# EAGLE design templog (EAGLE 9.5.0)
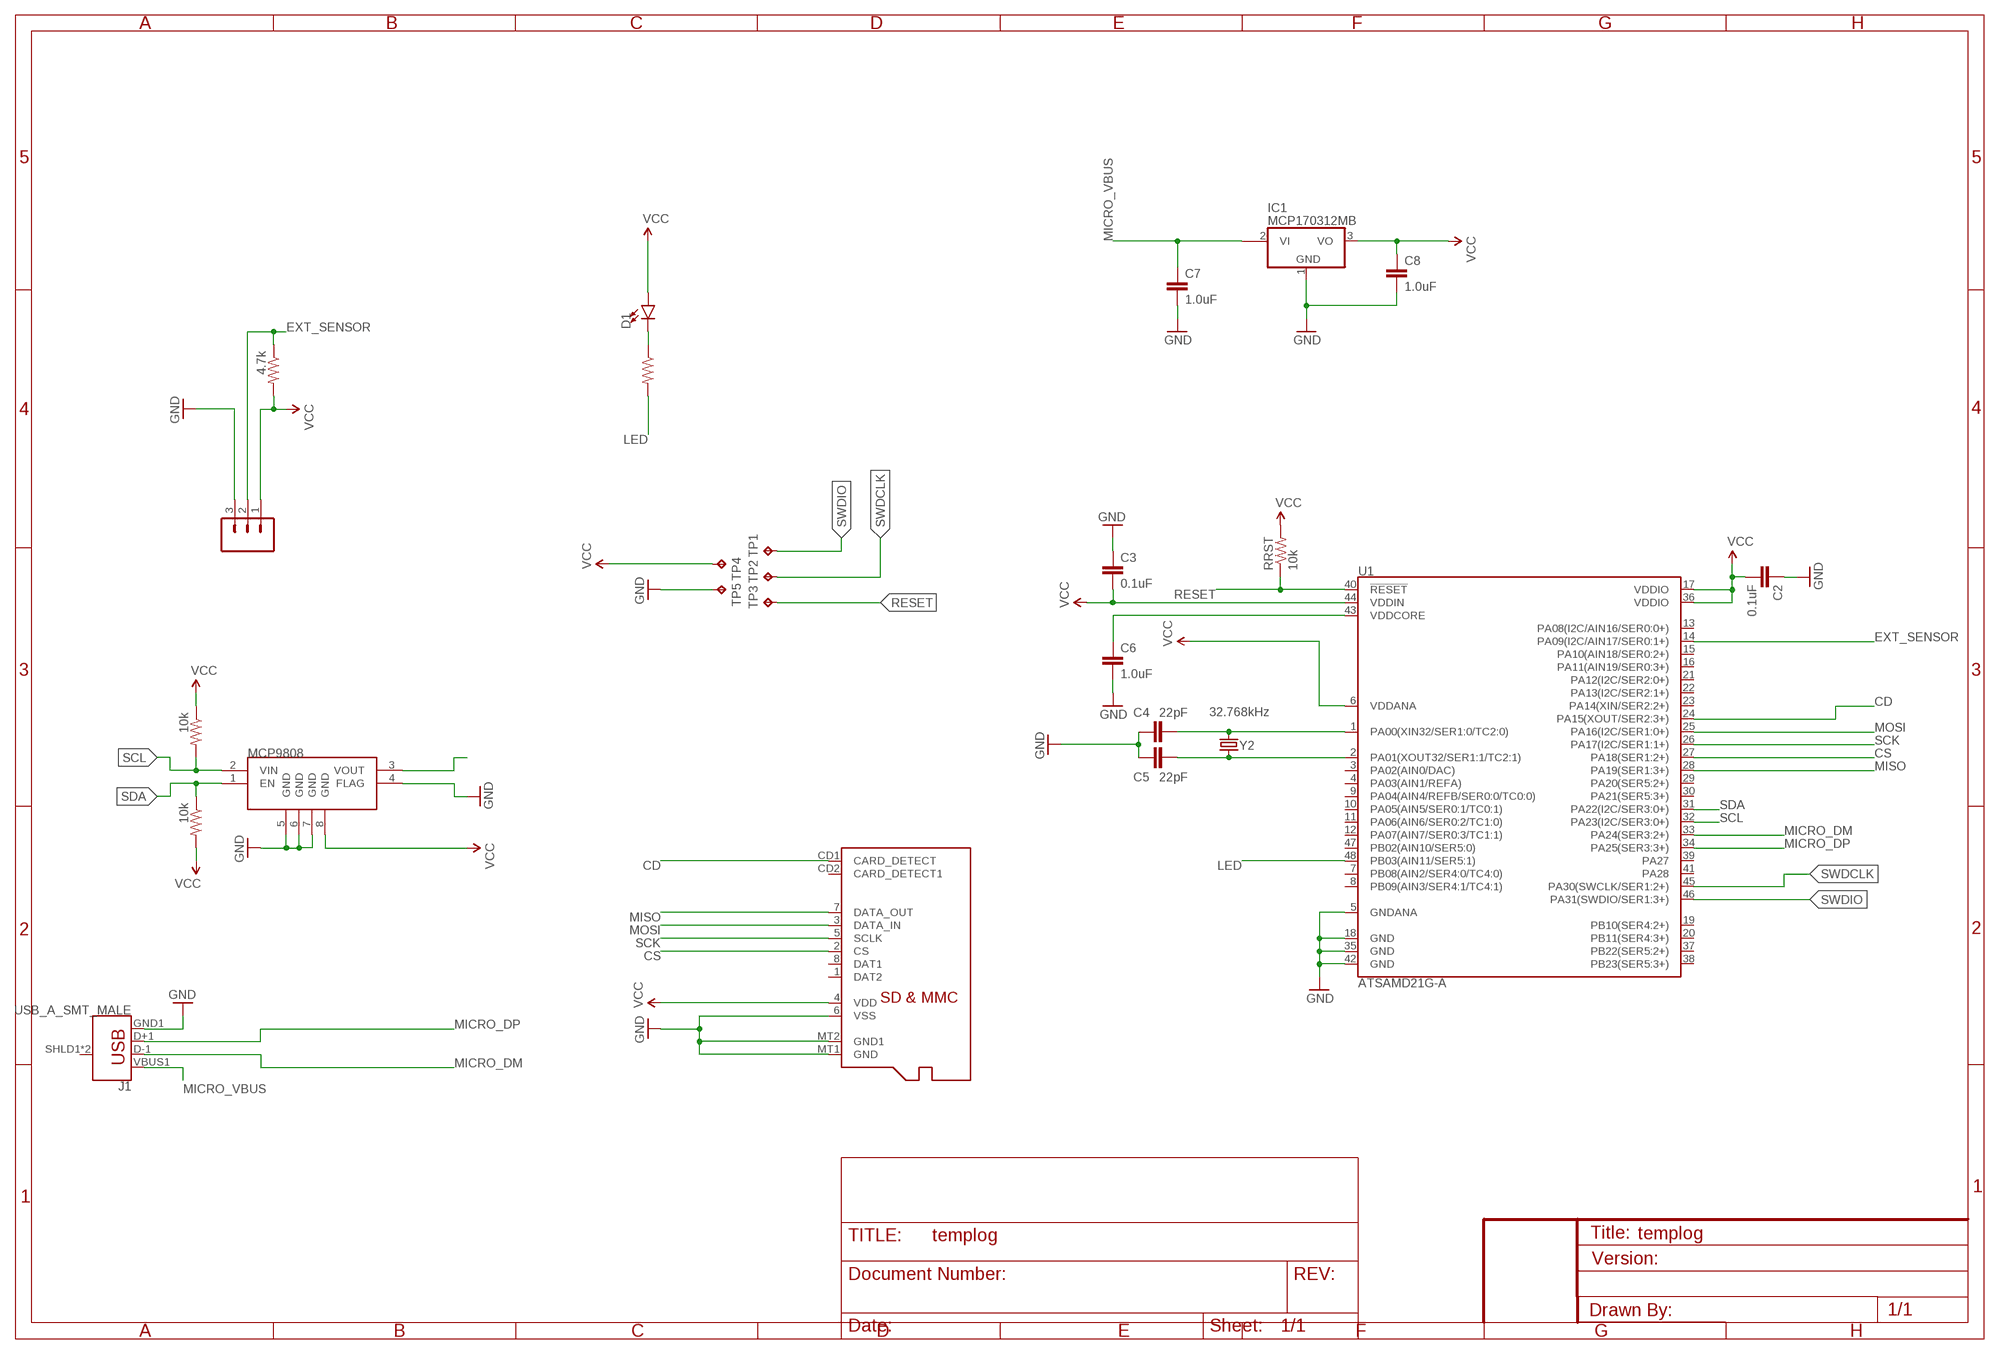
[diagram p0: schematic, sheet 1]

## Parts
C2  0.1uF  1.0UF-0805-25V-10%  [0805]
C3  0.1uF  1.0UF-0805-25V-10%  [0805]
C4  22pF  CAP0805  [0805]
C5  22pF  CAP0805  [0805]
C6  1.0uF  1.0UF-0805-25V-10%  [0805]
C7  1.0uF  1.0UF-0805-25V-10%  [0805]
C8  1.0uF  1.0UF-0805-25V-10%  [0805]
D1  LED1206  [LED-1206]
IC1  MCP170312MB  [SOT89]
J1  USB_A_SMT_MALE  [USB-A-SMT-MALE]
J2  CONN_03SMD  [1X03-1MM-RA]
MCP9808  V_REG_MIC5216  [MSOP8]
R_I2C_1  10k  RESISTOR0805-RES  [0805]
R_I2C_2  10k  RESISTOR0805-RES  [0805]
R_I2C_3  4.7k  RESISTOR0805-RES  [0805]
R_I2C_4  RESISTOR0805-RES  [0805]
RRST  10k  RESISTOR0805-RES  [0805]
TP1  TPB1,27  [B1,27]
TP2  TPB1,27  [B1,27]
TP3  TPB1,27  [B1,27]
TP4  TPB1,27  [B1,27]
TP5  TPB1,27  [B1,27]
U1  ATSAMD21G-A  [TQFP-48]
U$1  MICROSD  [MICROSD]
Y2  32.768kHz  CRYSTAL3.2X1.5MM  [CRYSTAL-SMD-3.2X1.5MM]

## Nets
CD: U1.24(PA15(XOUT/SER2:3+)) U$1.CD1(CARD_DETECT)
CS: U1.27(PA18(SER1:2+)) U$1.2(CS)
EXT_SENSOR: J2.2 R_I2C_3.1 U1.14(PA09(I2C/AIN17/SER0:1+))
GND: C2.1 C3.1 C4.1 C5.1 C6.2 C7.2 C8.2 IC1.1(GND) J1.GND1(GND) J2.3 MCP9808.4(FLAG) MCP9808.5(GND) MCP9808.6(GND) MCP9808.7(GND) TP5.TP U1.5(GNDANA) U1.18(GND) U1.35(GND) U1.42(GND) U$1.6(VSS) U$1.MT1(GND) U$1.MT2(GND1)
LED: R_I2C_4.2 U1.48(PB03(AIN11/SER5:1))
MICRO_DM: J1.D-1(D-) U1.33(PA24(SER3:2+))
MICRO_DP: J1.D+1(D+) U1.34(PA25(SER3:3+))
MICRO_VBUS: C7.1 IC1.2@1(VI1) J1.VBUS1(VBUS)
MISO: U1.28(PA19(SER1:3+)) U$1.7(DATA_OUT)
MOSI: U1.25(PA16(I2C/SER1:0+)) U$1.3(DATA_IN)
N$1: C6.1 U1.43(VDDCORE)
N$4: MCP9808.3(VOUT)
N$5: D1.C R_I2C_4.1
N$8: C4.2 U1.1(PA00(XIN32/SER1:0/TC2:0)) Y2.P$2
N$32: C5.2 U1.2(PA01(XOUT32/SER1:1/TC2:1)) Y2.P$1
RESET: RRST.1 TP3.TP U1.40(!RESET!)
SCK: U1.26(PA17(I2C/SER1:1+)) U$1.5(SCLK)
SCL: MCP9808.2(VIN) R_I2C_1.2 U1.32(PA23(I2C/SER3:0+))
SDA: MCP9808.1(EN) R_I2C_2.1 U1.31(PA22(I2C/SER3:0+))
SWDCLK: TP2.TP U1.45(PA30(SWCLK/SER1:2+))
SWDIO: TP1.TP U1.46(PA31(SWDIO/SER1:3+))
VCC [power]: C2.2 C3.2 C8.1 D1.A IC1.3(VO) J2.1 MCP9808.8(GND) R_I2C_1.1 R_I2C_2.2 R_I2C_3.2 RRST.2 TP4.TP U1.6(VDDANA) U1.17(VDDIO) U1.36(VDDIO) U1.44(VDDIN) U$1.4(VDD)
Unconnected: IC1.2(VI) J1.SHLD1(SHIELD) J1.SHLD2(SHIELD) U1.3(PA02(AIN0/DAC)) U1.4(PA03(AIN1/REFA)) U1.7(PB08(AIN2/SER4:0/TC4:0)) U1.8(PB09(AIN3/SER4:1/TC4:1)) U1.9(PA04(AIN4/REFB/SER0:0/TC0:0)) U1.10(PA05(AIN5/SER0:1/TC0:1)) U1.11(PA06(AIN6/SER0:2/TC1:0)) U1.12(PA07(AIN7/SER0:3/TC1:1)) U1.13(PA08(I2C/AIN16/SER0:0+)) U1.15(PA10(AIN18/SER0:2+)) U1.16(PA11(AIN19/SER0:3+)) U1.19(PB10(SER4:2+)) U1.20(PB11(SER4:3+)) U1.21(PA12(I2C/SER2:0+)) U1.22(PA13(I2C/SER2:1+)) U1.23(PA14(XIN/SER2:2+)) U1.29(PA20(SER5:2+)) U1.30(PA21(SER5:3+)) U1.37(PB22(SER5:2+)) U1.38(PB23(SER5:3+)) U1.39(PA27) U1.41(PA28) U1.47(PB02(AIN10/SER5:0)) U$1.1(DAT2) U$1.8(DAT1) U$1.CD2(CARD_DETECT1)

## Library data of the parts
C2 C3 = SparkFun-Capacitors:1.0UF: 1µF ceramic capacitors A capacitor is a passive two-terminal electrical component used to store electrical energy temporarily in an electric field.; PROD_ID: CAP-08064; VALUE: 1.0uF
C4 C5 = SparkFun-Passives:CAP: Capacitor Standard 0603 ceramic capacitor, and 0.1" leaded capacitor.
C6-C8 = SparkFun-Capacitors:1.0UF: 1µF ceramic capacitors A capacitor is a passive two-terminal electrical component used to store electrical energy temporarily in an electric field.; PROD_ID: CAP-08064
D1 = SparkFun-LED:LED: LED (Generic) Standard schematic elements and footprints for 5mm, 3mm, 1206, and 0603 sized LEDs. Generic LEDs with no color specified.
IC1 = linear:MCP1703*: 250 mA, 16V, Low Quiescent Current LDO Regulator Source: http://ww1.microchip.com/downloads/en/DeviceDoc/22049b.pdf
J1 = SparkFun-Connectors:USB_A: USB-A Connector Male and female variants, as well as PTH and SMT variants SparkFun Products: SparkFun XBee Explorer Dongle <https://www.sparkfun.com/products/11697> PTH Male SparkFun MicroView-USB Programmer <https://www.sparkfun.com/products/12924> SMT Male SparkFun USB Type A Female Breakout <https://www.sparkfun.com/products/12700> SMT Female; PROD_ID: CONN-11499
J2 = SparkFun-Connectors:CONN_03: Multi connection point. Often used as Generic Header-pin footprint for 0.1 inch spaced/style header connections On any of the 0.1 inch spaced packages, you can populate with these: Break Away Headers - Straight <https://www.sparkfun.com/products/116> (PRT-00116) Break Away Male Headers - Right Angle <https://www.sparkfun.com/products/553> (PRT-00553) Female Headers <https://www.sparkfun.com/products/115> (PRT-00115) Break Away Headers - Machine Pin <https://www.sparkfun.com/products/117> (PRT-00117) Break Away Female Headers - Swiss Machine Pin <https://www.sparkfun.com/products/743> (PRT-00743) Stackable Header - 3 Pin (Female, 0.1") <https://www.sparkfun.com/products/13875> (PRT-13875) For SCREWTERMINALS and SPRING TERMINALS visit here: Screw Terimnals on SparkFun.com <https://www.sparkfun.com/search/results?term=Screw+Terminals> (5mm/3.5mm/2.54mm spacing) This device is also useful as a general connection point to wire up your design to another part of your project. Our various solder wires solder well into these plated through hole pads. Hook-Up Wire - Assortment (Stranded, 22 AWG) <https://www.sparkfun.com/products/11375> (PRT-11375) Hook-Up Wire - Assortment (Solid Core, 22 AWG) <https://www.sparkfun.com/products/11367> (PRT-11367) View the entire wire category on our website here <https://www.sparkfun.com/categories/141> Special notes: Molex polarized connector foot print use with SKU : PRT-08232 with associated crimp pins and housings.
MCP9808 = SparkFun-IC-Power:V_REG_MIC5216: 500mA LDO, MSOP8 for better dissipation; PROD_ID: IC-09527
R_I2C_1-R_I2C_4 RRST = SparkFun-Passives:RESISTOR: Resistor Basic schematic elements and footprints for 0603, 1206, and PTH resistors.
TP1-TP5 = testpad:TP: Test pad
U1 = SparkFun-IC-Microcontroller:ATSAMD21G: Atmel SAMD21G SMART ARM-Based Microcontroller The Atmel ® | SMART ™ SAM D21 is a series of low-power microcontrollers using the 32-bit ARM ® Cortex ® -M0+ processor, and ranging from 32- to 64-pins with up to 256KB Flash and 32KB of SRAM. The SAM D21 devices operate at a maximum frequency of 48MHz and reach 2.46 CoreMark/MHz. They are designed for simple and intuitive migration with identical peripheral modules, hex compatible code, identical linear address map and pin compatible migration paths between all devices in the product series. All devices include intelligent and flexible peripherals, Atmel Event System for inter-peripheral signaling, and support for capacitive touch button, slider and wheel user interfaces. Datasheet <https://cdn.sparkfun.com/datasheets/Dev/Arduino/Boards/Atmel-42181-SAM-D21_Datasheet.pdf> SparkFun Products SparkFun SAMD21 Mini Breakout <https://www.sparkfun.com/products/13664> (DEV-13664) SparkFun SAMD21 Dev Breakout <https://www.sparkfun.com/products/13672> (DEV-13672); PROD_ID: IC-13064
U$1 = adafruit:MICROSD: Micro-SD / Transflash card holder with SPI pinout For the 3M # 2908-05WB-MG and/or 4UCON #19656 push-push type
Y2 = samd21-temp:CRYSTAL: Various standard crystals. Proven footprints.; PROD_ID: XTAL-13062

## Net classes
0 default: width 0.203 mm, clearance 0.152 mm
1 power: width 0.254 mm, clearance 0.203 mm
2 camera_power: width 0.66 mm, clearance 0.254 mm
3 usbsignal: width 0.254 mm, clearance 0.203 mm
4 highpower: clearance 0.305 mm

## Board
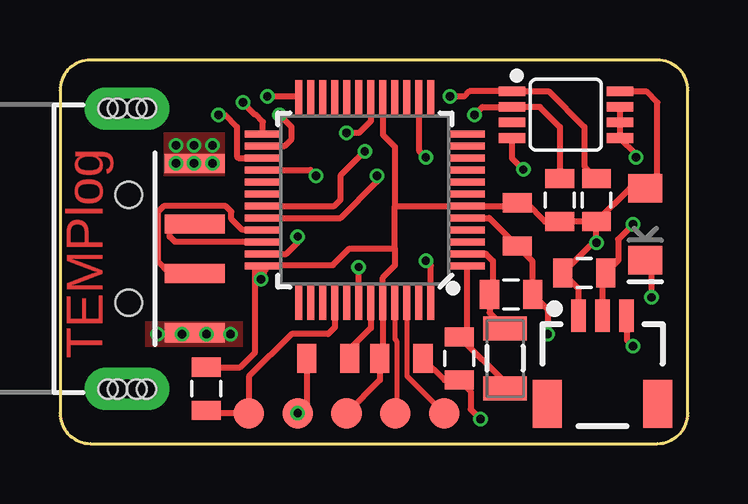
[diagram p1: board, top side]
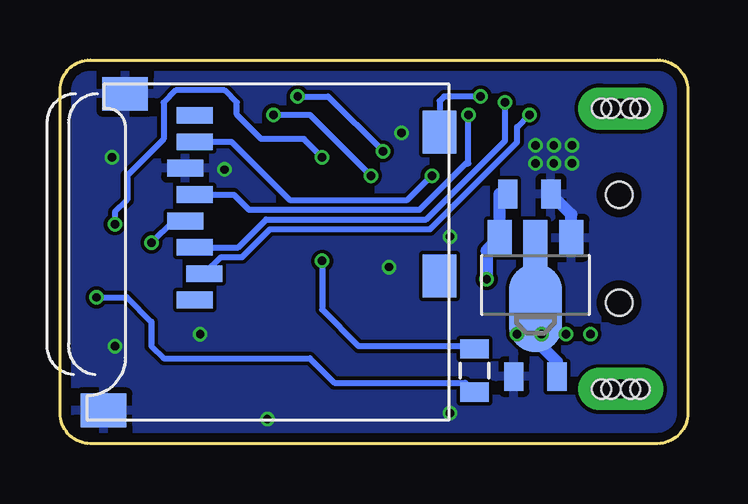
[diagram p2: board, bottom side, seen from below]

Size 26.16 x 16 mm. Coordinates in mm from the lower left corner, seen from the top.
Outline: 24.89,16 1.27,16 arc90 0,14.73 0,1.27 arc90 1.27,0 24.89,0 arc90 26.16,1.27 26.16,14.73 arc90 24.89,16
Copper layers (1*16): Top 0.035559375mm / dielectric 1.6mm / Bottom 0.035559375mm
Design rules "oshpark-2layer": minimum track width 6mil, minimum drill 10mil, track to track 6mil, track to pad 6mil, pad to pad 6mil, via to via 6mil, smd to smd 6mil, copper to edge 15mil, drill to drill 6mil, minimum pad ring 5mil, minimum via ring 5mil, stop-mask expansion 2.5mil, vias tented up to drill 0mil, thermal gap 10mil

### Footprints (pad centres in the part's own frame; a part is rotated, then mirrored left to right if it is on the bottom)
0805 = smd 0.8 x 1.2: 1 -0.9,0; 2 0.9,0
LED-1206 = smd 1.2 x 1.4: A -1.5,0; C 1.5,0
SOT89 = smd 1 x 1.5: 1 -1.499,-1.981; 3 1.499,-1.981 | smd 1 x 2: 2 0,-1.727 | smd 2.2 x 3.7: 2@1 0,0.94
USB-A-SMT-MALE = smd 2.5 x 0.8: D+1 10.95,1.027; D-1 10.95,-1.027; GND1 10.95,3.551; VBUS1 10.95,-3.5 | drill 0.8 pad 1.778 long: SHLD1 8.13,-5.85; SHLD2 8.13,5.85 | hole 1.1: 8.2,2.25; 8.2,-2.25 | hole 0.8: 8.53,-5.85; 8.93,-5.85; 7.73,-5.85; 7.33,-5.85; 8.53,5.85; 8.93,5.85; 7.73,5.85; 7.33,5.85
1X03-1MM-RA = smd 0.6 x 1.35: 1 -1,0; 2 0,0; 3 1,0 | smd 1.2 x 2: NC1 2.3,-3.675; NC2 -2.3,-3.675
MSOP8 = smd 0.4 x 1.1: 1 -0.975,-2.25; 2 -0.325,-2.25; 3 0.325,-2.25; 4 0.975,-2.25; 5 0.975,2.25; 6 0.325,2.25; 7 -0.325,2.25; 8 -0.975,2.25
B1,27 = smd 1.27 x 1.27: TP 0,0
TQFP-48 = smd 1.5 x 0.28: 1 -4.25,2.75; 2 -4.25,2.25; 3 -4.25,1.75; 4 -4.25,1.25; 5 -4.25,0.75; 6 -4.25,0.25; 7 -4.25,-0.25; 8 -4.25,-0.75; 9 -4.25,-1.25; 10 -4.25,-1.75; 11 -4.25,-2.25; 12 -4.25,-2.75; 25 4.25,-2.75; 26 4.25,-2.25; 27 4.25,-1.75; 28 4.25,-1.25; 29 4.25,-0.75; 30 4.25,-0.25; 31 4.25,0.25; 32 4.25,0.75; 33 4.25,1.25; 34 4.25,1.75; 35 4.25,2.25; 36 4.25,2.75 | smd 0.28 x 1.5: 13 -2.75,-4.25; 14 -2.25,-4.25; 15 -1.75,-4.25; 16 -1.25,-4.25; 17 -0.75,-4.25; 18 -0.25,-4.25; 19 0.25,-4.25; 20 0.75,-4.25; 21 1.25,-4.25; 22 1.75,-4.25; 23 2.25,-4.25; 24 2.75,-4.25; 37 2.75,4.25; 38 2.25,4.25; 39 1.75,4.25; 40 1.25,4.25; 41 0.75,4.25; 42 0.25,4.25; 43 -0.25,4.25; 44 -0.75,4.25; 45 -1.25,4.25; 46 -1.75,4.25; 47 -2.25,4.25; 48 -2.75,4.25
MICROSD = smd 0.7 x 1.5: 1 9,-10.64; 2 7.9,-10.24; 3 6.8,-10.64; 4 5.7,-11.04; 5 4.6,-10.64; 6 3.5,-11.04; 7 2.4,-10.64; 8 1.3,-10.64 | smd 1.8 x 1.4: CD1 2,-0.44; CD2 8,-0.44 | smd 1.4 x 1.9: MT1 0.4,-13.54; MT2 13.6,-14.44
CRYSTAL-SMD-3.2X1.5MM = smd 1 x 1.8: P$1 -1.25,0; P$2 1.25,0

### Placement (x,y rotation side)
C2  14.22,3.56 180 top
C3  19.05,9.14 90 top
C4  16.64,3.56 90 top
C5  18.8,6.22 180 top
C6  11.18,3.56 180 top
C7  6.35,2.79 180 bottom
C8  6.6,10.41 0 bottom
D1  24.38,9.14 270 top
IC1  6.35,6.6 180 bottom
J1  -5.33,8.13 0 top
J2  22.61,5.33 0 top
MCP9808  21.08,13.72 270 top
R_I2C_1  20.83,10.16 90 top
R_I2C_2  22.35,10.16 270 top
R_I2C_3  21.84,7.11 180 top
R_I2C_4  8.89,3.05 90 bottom
RRST  6.1,2.29 90 top
TP1  16,1.27 180 top
TP2  13.97,1.27 180 top
TP3  7.87,1.27 180 top
TP4  11.94,1.27 180 top
TP5  9.91,1.27 180 top
U1  12.7,10.16 180 top
U$1  9.91,14.99 270 bottom
Y2  18.54,3.56 270 top

### Tracks (layer width: path | path; a pad name or v marks a point on that pad's centre or on a via)
CD  (via drill 0.35)
  Top 0.254: U1.24 9.95,14.48 v8.64,14.48
  Bottom 0.254: v8.64,14.48 10.16,14.48 10.35,14.29 U$1.CD1
CS  (via drill 0.35)
  Top 0.254: v6.6,13.72 6.86,13.72 7.37,13.21 7.37,11.97 7.43,11.91 U1.27
  Bottom 0.254: U$1.2 19.45,7.78 18.57,7.78 17.41,8.94 10.74,8.94 7.11,12.57 7.11,13.21 v6.6,13.72
EXT_SENSOR  (via drill 0.35)
  Top 0.254: J2.2 22.61,6.97 R_I2C_3.1 23.25,7.62 23.25,8.52 v23.88,9.14 | U1.14 14.95,12.23 v15.24,11.94
  Bottom 0.254: v15.24,11.94 16,12.7 17.78,12.7 18.8,13.72 18.8,14.22 19.3,14.73 21.34,14.73 21.84,14.22 21.84,12.7 23.37,11.18 23.37,10.16 23.88,9.65 v23.88,9.14
GND  (via drill 0.35)
  Top 0.254: C6.2 10.28,1.64 TP5.TP | U1.42 v12.45,7.36 v12.45,7.37 | MCP9808.7 MCP9808.6 MCP9808.5 24,12.07 v24,11.94 | U1.5 17.88,9.41 C3.1 19.7,7.6 C5.1 20.32,5.6 v20.32,4.57 | J2.3 23.62,5.32 23.62,4.32 v23.88,4.06 | C2.1 16.02,2.66 C4.1 17.11,2.18 17.11,1.43 v17.53,1.02 | U1.35 9.43,7.91 9.91,8.38 v9.91,8.64 | U1.18 12.95,13.46 12.45,12.95 v11.94,12.95 | MCP9808.4 18.83,11.9 v19.3,11.43
  Bottom 0.508: IC1.1 4.85,9.56 C8.2
  other vias: 9.91,1.27 4.83,12.45 5.59,12.45 6.35,12.45 6.35,11.68 5.59,11.68 4.83,11.68
  pour Bottom (rank 2): 0,0.25 25.91,0.25 25.91,15.75 0,15.75
  pour Top (no thermals): 4.32,11.18 6.86,11.18 6.86,12.95 4.32,12.95 4.32,11.43
LED  (via drill 0.35)
  Top 0.254: U1.48 15.45,7.41 v15.24,7.62
  Bottom 0.254: v15.24,7.62 15.24,5.59 13.72,4.06 9.01,4.06 R_I2C_4.2
MICRO_DM
  Top 0.254: U1.33 7.6,8.91 7.14,9.37 7.14,9.67 6.91,9.91 4.32,9.91 4.06,9.65 4.06,7.62 4.58,7.1 J1.D-1
MICRO_DP
  Top 0.254: U1.34 4.8,8.41 4.57,8.64 4.57,9.14 4.58,9.15 J1.D+1
MICRO_VBUS  (via drill 0.35)
  Bottom 0.254: IC1.2@1 6.35,4.83 v6.1,4.57
  Bottom 0.508: C7.1 5.45,3.42 6.6,4.57 v7.11,4.57
  other vias: 4.06,4.57 5.08,4.57
  pour Top (no thermals): 7.62,5.08 3.56,5.08 3.56,4.06 7.62,4.06
MISO  (via drill 0.35)
  Top 0.254: U1.28 10.43,11.41 v10.67,11.18
  Bottom 0.254: U$1.7 19.02,12.59 16.6,10.16 11.68,10.16 v10.67,11.18
MOSI  (via drill 0.35)
  Top 0.254: U1.25 8.45,13.42 8.13,13.74 8.1,13.74 v7.62,14.22
  Bottom 0.254: U$1.3 18.74,8.19 17.58,9.35 10.91,9.35 7.62,12.63 v7.62,14.22
N$1
  Top 0.254: U1.43 12.95,4.82 12.08,3.95 C6.1
N$5  (via drill 0.35)
  Top 0.254: D1.C 24.64,7.39 v24.64,6.1
  Bottom 0.254: v24.64,6.1 23.37,6.1 22.35,5.08 22.35,4.06 21.84,3.56 15.75,3.56 14.73,2.54 9.28,2.54 R_I2C_4.1
N$8
  Top 0.254: U1.1 16.95,4.77 C4.2 18.54,2.55 Y2.P$2
N$32
  Top 0.254: U1.2 17.74,7.91 18.03,7.62 18.03,6.36 C5.2 17.9,5.45 Y2.P$1
RESET
  Top 0.254: U1.40 11.45,4.85 11.18,4.57 9.65,4.57 7.87,2.79 TP3.TP 6.21,1.27 RRST.1
SCK  (via drill 0.35)
  Top 0.254: U1.26 9.36,12.41 9.65,12.7 9.65,13.21 v9.14,13.72
  Bottom 0.254: U$1.5 18.92,10.39 18.29,9.75 11.18,9.75 9.25,11.68 9.14,11.68 v9.14,13.72
SCL  (via drill 0.35)
  Top 0.254: R_I2C_1.2 20.83,13.21 20,14.04 MCP9808.2 17.6,14.04 v17.27,13.72 | U1.32 11.7,9.41 13.21,10.92 v13.21,11.18
  Bottom 0.254: v13.21,11.18 15.75,13.72 v17.27,13.72
SDA  (via drill 0.35)
  Top 0.254: U1.31 11.43,9.91 11.68,10.16 11.68,11.18 v12.7,12.19 | v16.26,14.48 16.84,14.48 17.05,14.69 MCP9808.1 20.36,14.69 21.84,13.21 21.84,11.57 R_I2C_2.1
  Bottom 0.254: v12.7,12.19 14.99,14.48 v16.26,14.48
SWDCLK
  Top 0.203: U1.45 13.95,4.36 14.03,4.28 14.03,1.33 TP2.TP
SWDIO
  Top 0.203: U1.46 14.45,2.82 TP1.TP
VCC  (via drill 0.35)
  Top 0.254: TP4.TP 13.32,2.66 C2.2 13.45,3.68 U1.44 13.45,6.93 13.96,7.43 13.96,8.13 | J2.1 21.61,6.45 R_I2C_3.2 22.21,8.38 v22.35,8.38 R_I2C_2.2 | U1.17 13.45,12.89 13.96,12.38 13.96,9.92 13.97,9.91 | 13.97,9.91 13.96,9.91 13.96,8.13 | 13.97,9.91 U1.6 18.92,9.91 C3.2 19.42,10.04 20.2,9.26 R_I2C_1.1 R_I2C_2.2 | 8.48,7.44 U1.36 8.45,7.31 | 8.48,7.44 8.13,7.44 8.13,3.81 7.5,3.19 RRST.2 | 8.48,7.44 11.37,7.44 12.06,8.13 13.96,8.13 | MCP9808.8 24.43,14.69 24.89,14.22 24.89,11.15 D1.A 23.74,10.64 R_I2C_2.2
  Top 0.508: v8.38,6.86 8.38,7.24 8.45,7.31
  Bottom 0.254: U$1.4 21.45,9.29 v22.35,8.38
  Bottom 0.508: C8.1 7.85,10.41 IC1.3 8.38,8.05 v8.38,6.86

### Text on the board
Top: TEMPlog